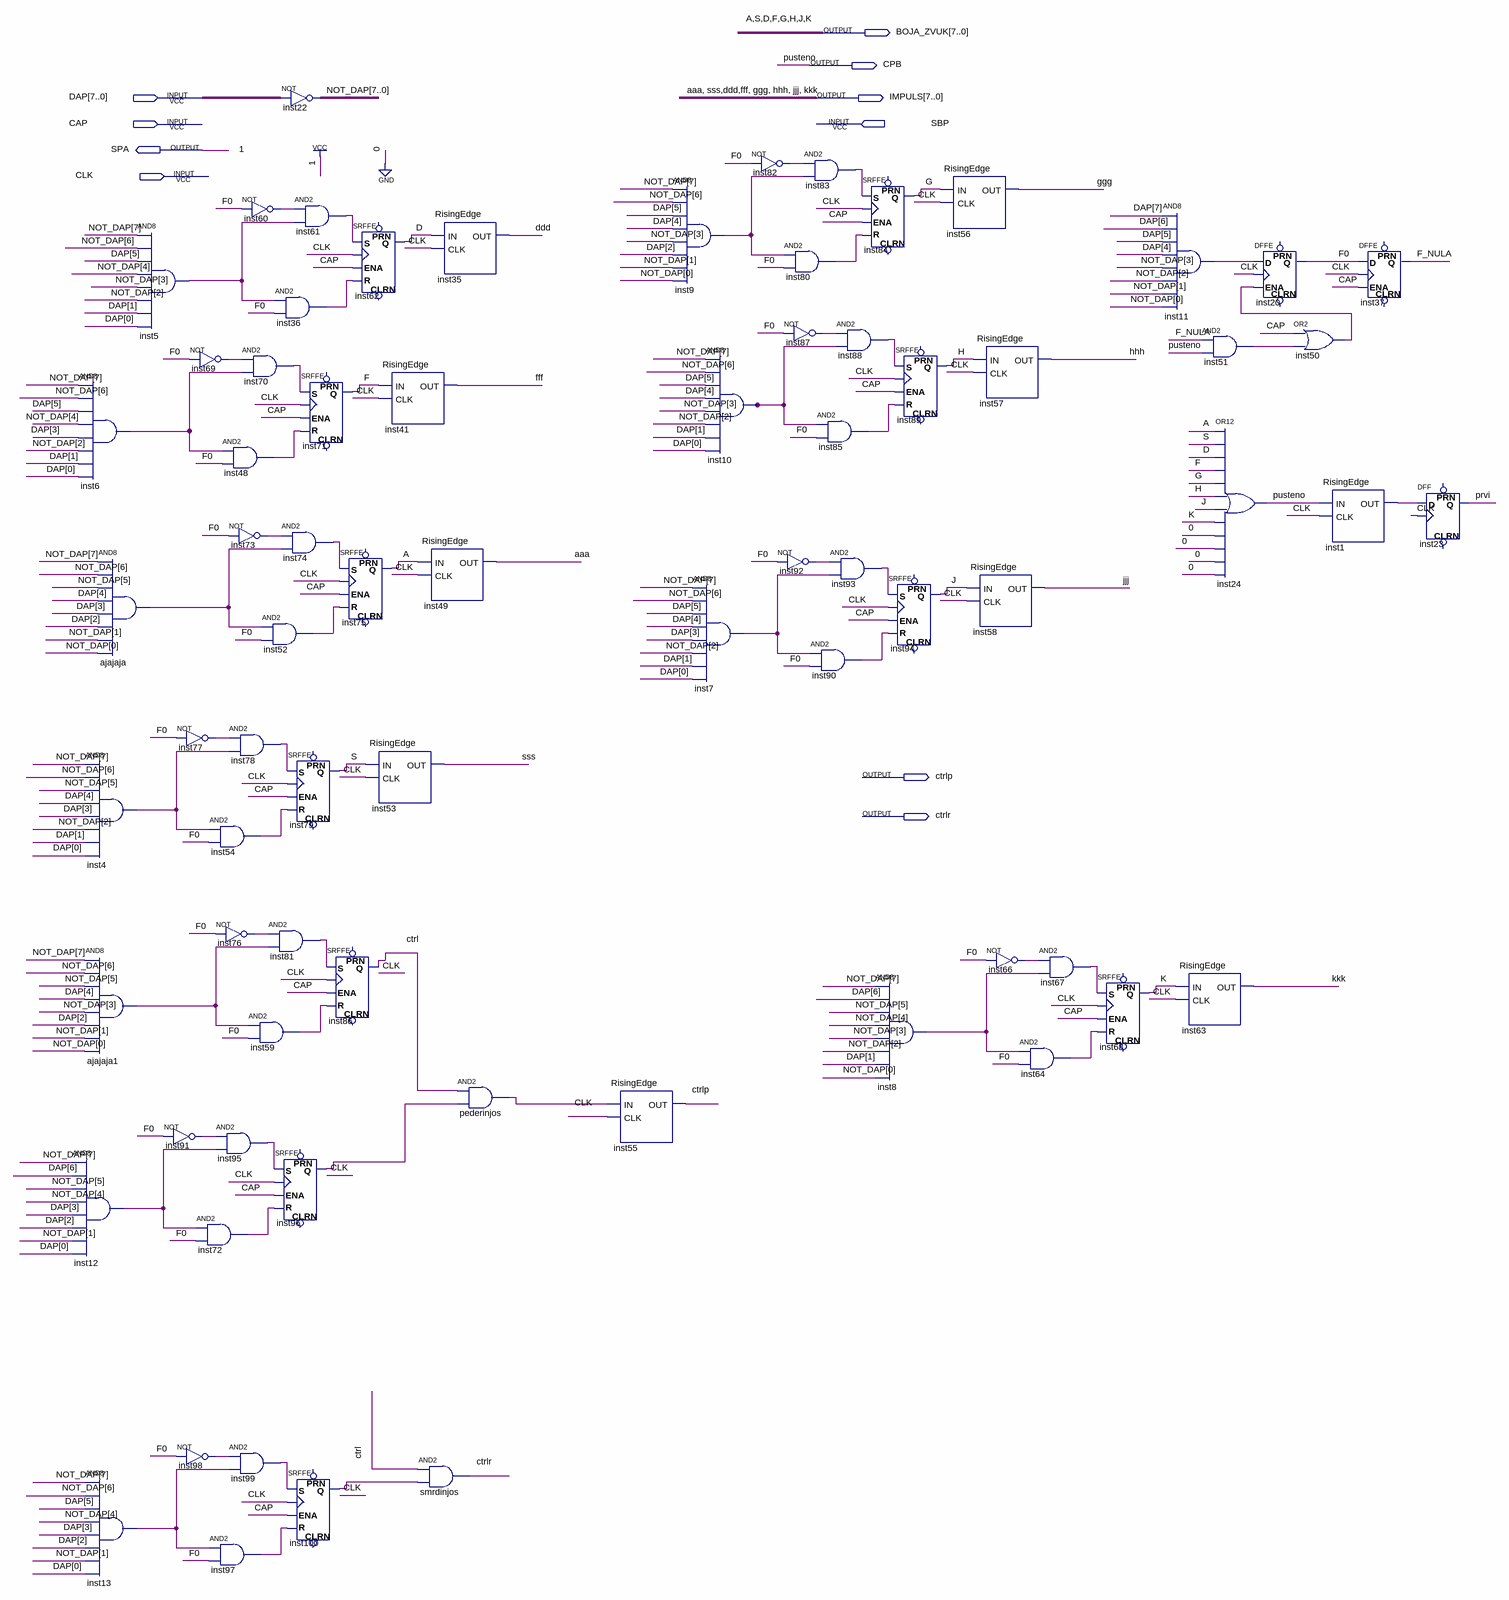
[diagram p0: schematic sheet]
// Quartus schematic Tastatura.bdf as structural Verilog: 75 symbols, 10 pins
module Tastatura (
  input  [7:0] DAP,
  input  CAP,
  input  SBP,
  input  CLK,
  output [7:0] BOJA_ZVUK,
  output CPB,
  output [7:0] IMPULS,
  output SPA,
  output ctrlp,
  output ctrlr
);

  wire ajajaja1_out, ajajaja_out, ctrl, F0, F_NULA, inst1_out, inst4_out, inst5_out, inst6_out, inst7_out,
       inst8_out, inst9_out, inst10_out, inst11_out, inst12_out, inst13_out, inst36_out, inst48_out,
       inst50_out, inst51_out, inst52_out, inst54_out, inst59_out, inst60_out, inst61_out, inst64_out,
       inst66_out, inst67_out, inst69_out, inst70_out, inst72_out, inst73_out, inst74_out, inst76_out,
       inst77_out, inst78_out, inst80_out, inst81_out, inst82_out, inst83_out, inst85_out, inst87_out,
       inst88_out, inst90_out, inst91_out, inst92_out, inst93_out, inst95_out, inst96_q, inst97_out,
       inst98_out, inst99_out, inst100_q, pederinjos_out, prvi;
  wire [7:0] NOT_DAP;

  and inst6 (inst6_out, NOT_DAP[7], NOT_DAP[6], DAP[5], NOT_DAP[4], DAP[3], NOT_DAP[2], DAP[1], DAP[0]);
  and ajajaja (ajajaja_out, NOT_DAP[7], NOT_DAP[6], NOT_DAP[5], DAP[4], DAP[3], DAP[2], NOT_DAP[1], NOT_DAP[0]);
  and inst4 (inst4_out, NOT_DAP[7], NOT_DAP[6], NOT_DAP[5], DAP[4], DAP[3], NOT_DAP[2], DAP[1], DAP[0]);
  and ajajaja1 (ajajaja1_out, NOT_DAP[7], NOT_DAP[6], NOT_DAP[5], DAP[4], NOT_DAP[3], DAP[2], NOT_DAP[1], NOT_DAP[0]);
  and inst12 (inst12_out, NOT_DAP[7], DAP[6], NOT_DAP[5], NOT_DAP[4], DAP[3], DAP[2], NOT_DAP[1], DAP[0]);
  and inst13 (inst13_out, NOT_DAP[7], NOT_DAP[6], DAP[5], NOT_DAP[4], DAP[3], DAP[2], NOT_DAP[1], DAP[0]);
  and inst5 (inst5_out, NOT_DAP[7], NOT_DAP[6], DAP[5], NOT_DAP[4], NOT_DAP[3], NOT_DAP[2], DAP[1], DAP[0]);
  not inst91 (inst91_out, F0);
  not inst69 (inst69_out, F0);
  not inst77 (inst77_out, F0);
  and inst54 (inst54_out, inst4_out, F0);
  not inst76 (inst76_out, F0);
  and inst95 (inst95_out, inst91_out, inst12_out);
  and inst72 (inst72_out, inst12_out, F0);
  not inst98 (inst98_out, F0);
  and inst97 (inst97_out, inst13_out, F0);
  not inst60 (inst60_out, F0);
  and inst70 (inst70_out, inst69_out, inst6_out);
  and inst48 (inst48_out, inst6_out, F0);
  not inst73 (inst73_out, F0);
  and inst52 (inst52_out, ajajaja_out, F0);
  and inst78 (inst78_out, inst77_out, inst4_out);
  and inst81 (inst81_out, inst76_out, ajajaja1_out);
  and inst59 (inst59_out, ajajaja1_out, F0);
  and inst99 (inst99_out, inst98_out, inst13_out);
  assign NOT_DAP = ~DAP;  // NOT inst22, 8 bits wide
  and inst61 (inst61_out, inst60_out, inst5_out);
  and inst36 (inst36_out, inst5_out, F0);
  SRFFE inst71 (.S(inst70_out), .CLK(CLK), .R(inst48_out), .ENA(CAP), .Q(BOJA_ZVUK[4]));  // open: PRN, CLRN
  and inst74 (inst74_out, inst73_out, ajajaja_out);
  SRFFE inst79 (.S(inst78_out), .CLK(CLK), .R(inst54_out), .ENA(CAP), .Q(BOJA_ZVUK[6]));  // open: PRN, CLRN
  SRFFE inst96 (.S(inst95_out), .CLK(CLK), .R(inst72_out), .ENA(CAP), .Q(inst96_q));  // open: PRN, CLRN
  SRFFE inst100 (.S(inst99_out), .CLK(CLK), .R(inst97_out), .ENA(CAP), .Q(inst100_q));  // open: PRN, CLRN
  SRFFE inst62 (.S(inst61_out), .CLK(CLK), .R(inst36_out), .ENA(CAP), .Q(BOJA_ZVUK[5]));  // open: PRN, CLRN
  SRFFE inst75 (.S(inst74_out), .CLK(CLK), .R(inst52_out), .ENA(CAP), .Q(BOJA_ZVUK[7]));  // open: PRN, CLRN
  RisingEdge inst53 (.IN(BOJA_ZVUK[6]), .CLK(CLK), .OUT(IMPULS[6]));
  SRFFE inst86 (.S(inst81_out), .CLK(CLK), .R(inst59_out), .ENA(CAP), .Q(ctrl));  // open: PRN, CLRN
  RisingEdge inst41 (.IN(BOJA_ZVUK[4]), .CLK(CLK), .OUT(IMPULS[4]));
  RisingEdge inst49 (.IN(BOJA_ZVUK[7]), .CLK(CLK), .OUT(IMPULS[7]));
  and smrdinjos (ctrlr, ctrl, inst100_q);
  RisingEdge inst35 (.IN(BOJA_ZVUK[5]), .CLK(CLK), .OUT(IMPULS[5]));
  and pederinjos (pederinjos_out, ctrl, inst96_q);
  RisingEdge inst55 (.IN(pederinjos_out), .CLK(CLK), .OUT(ctrlp));
  and inst9 (inst9_out, NOT_DAP[7], NOT_DAP[6], DAP[5], DAP[4], NOT_DAP[3], DAP[2], NOT_DAP[1], NOT_DAP[0]);
  and inst10 (inst10_out, NOT_DAP[7], NOT_DAP[6], DAP[5], DAP[4], NOT_DAP[3], NOT_DAP[2], DAP[1], DAP[0]);
  and inst7 (inst7_out, NOT_DAP[7], NOT_DAP[6], DAP[5], DAP[4], DAP[3], NOT_DAP[2], DAP[1], DAP[0]);
  not inst82 (inst82_out, F0);
  and inst80 (inst80_out, inst9_out, F0);
  not inst87 (inst87_out, F0);
  not inst92 (inst92_out, F0);
  and inst83 (inst83_out, inst82_out, inst9_out);
  and inst88 (inst88_out, inst87_out, inst10_out);
  and inst85 (inst85_out, inst10_out, F0);
  and inst93 (inst93_out, inst92_out, inst7_out);
  and inst90 (inst90_out, inst7_out, F0);
  SRFFE inst84 (.S(inst83_out), .CLK(CLK), .R(inst80_out), .ENA(CAP), .Q(BOJA_ZVUK[3]));  // open: PRN, CLRN
  SRFFE inst89 (.S(inst88_out), .CLK(CLK), .R(inst85_out), .ENA(CAP), .Q(BOJA_ZVUK[2]));  // open: PRN, CLRN
  SRFFE inst94 (.S(inst93_out), .CLK(CLK), .R(inst90_out), .ENA(CAP), .Q(BOJA_ZVUK[1]));  // open: PRN, CLRN
  and inst8 (inst8_out, NOT_DAP[7], DAP[6], NOT_DAP[5], NOT_DAP[4], NOT_DAP[3], NOT_DAP[2], DAP[1], NOT_DAP[0]);
  RisingEdge inst56 (.IN(BOJA_ZVUK[3]), .CLK(CLK), .OUT(IMPULS[3]));
  RisingEdge inst57 (.IN(BOJA_ZVUK[2]), .CLK(CLK), .OUT(IMPULS[2]));
  RisingEdge inst58 (.IN(BOJA_ZVUK[1]), .CLK(CLK), .OUT(IMPULS[1]));
  not inst66 (inst66_out, F0);
  and inst67 (inst67_out, inst66_out, inst8_out);
  and inst64 (inst64_out, inst8_out, F0);
  SRFFE inst68 (.S(inst67_out), .CLK(CLK), .R(inst64_out), .ENA(CAP), .Q(BOJA_ZVUK[0]));  // open: PRN, CLRN
  and inst11 (inst11_out, DAP[7], DAP[6], DAP[5], DAP[4], NOT_DAP[3], NOT_DAP[2], NOT_DAP[1], NOT_DAP[0]);
  and inst51 (inst51_out, F_NULA, CPB);
  RisingEdge inst63 (.IN(BOJA_ZVUK[0]), .CLK(CLK), .OUT(IMPULS[0]));
  DFFE inst20 (.D(inst11_out), .CLK(CLK), .ENA(inst50_out), .Q(F0));  // open: PRN, CLRN
  or inst24 (CPB, BOJA_ZVUK[7], BOJA_ZVUK[6], BOJA_ZVUK[5], BOJA_ZVUK[4], BOJA_ZVUK[3], BOJA_ZVUK[2], BOJA_ZVUK[1], BOJA_ZVUK[0], 1'b0, 1'b0, 1'b0, 1'b0);
  or inst50 (inst50_out, CAP, inst51_out);
  DFFE inst37 (.D(F0), .CLK(CLK), .ENA(CAP), .Q(F_NULA));  // open: PRN, CLRN
  RisingEdge inst1 (.IN(CPB), .CLK(CLK), .OUT(inst1_out));
  DFF inst23 (.CLK(CLK), .D(inst1_out), .Q(prvi));  // open: CLRN, PRN

  assign SPA = 1'b1;

  // Other names for the same wires on the sheet: A = BOJA_ZVUK[7]; aaa = IMPULS[7]; D = BOJA_ZVUK[5]; ddd = IMPULS[5];
  //   F = BOJA_ZVUK[4]; fff = IMPULS[4]; G = BOJA_ZVUK[3]; ggg = IMPULS[3]; H = BOJA_ZVUK[2]; hhh = IMPULS[2];
  //   J = BOJA_ZVUK[1]; jjj = IMPULS[1]; K = BOJA_ZVUK[0]; kkk = IMPULS[0]; pusteno = CPB; S = BOJA_ZVUK[6];
  //   sss = IMPULS[6]
endmodule
